# Altium schematic sheet MX8M-Nano-Power.SchDoc: Nova
size A3; SheetNumber: 3; SheetTotal: 15
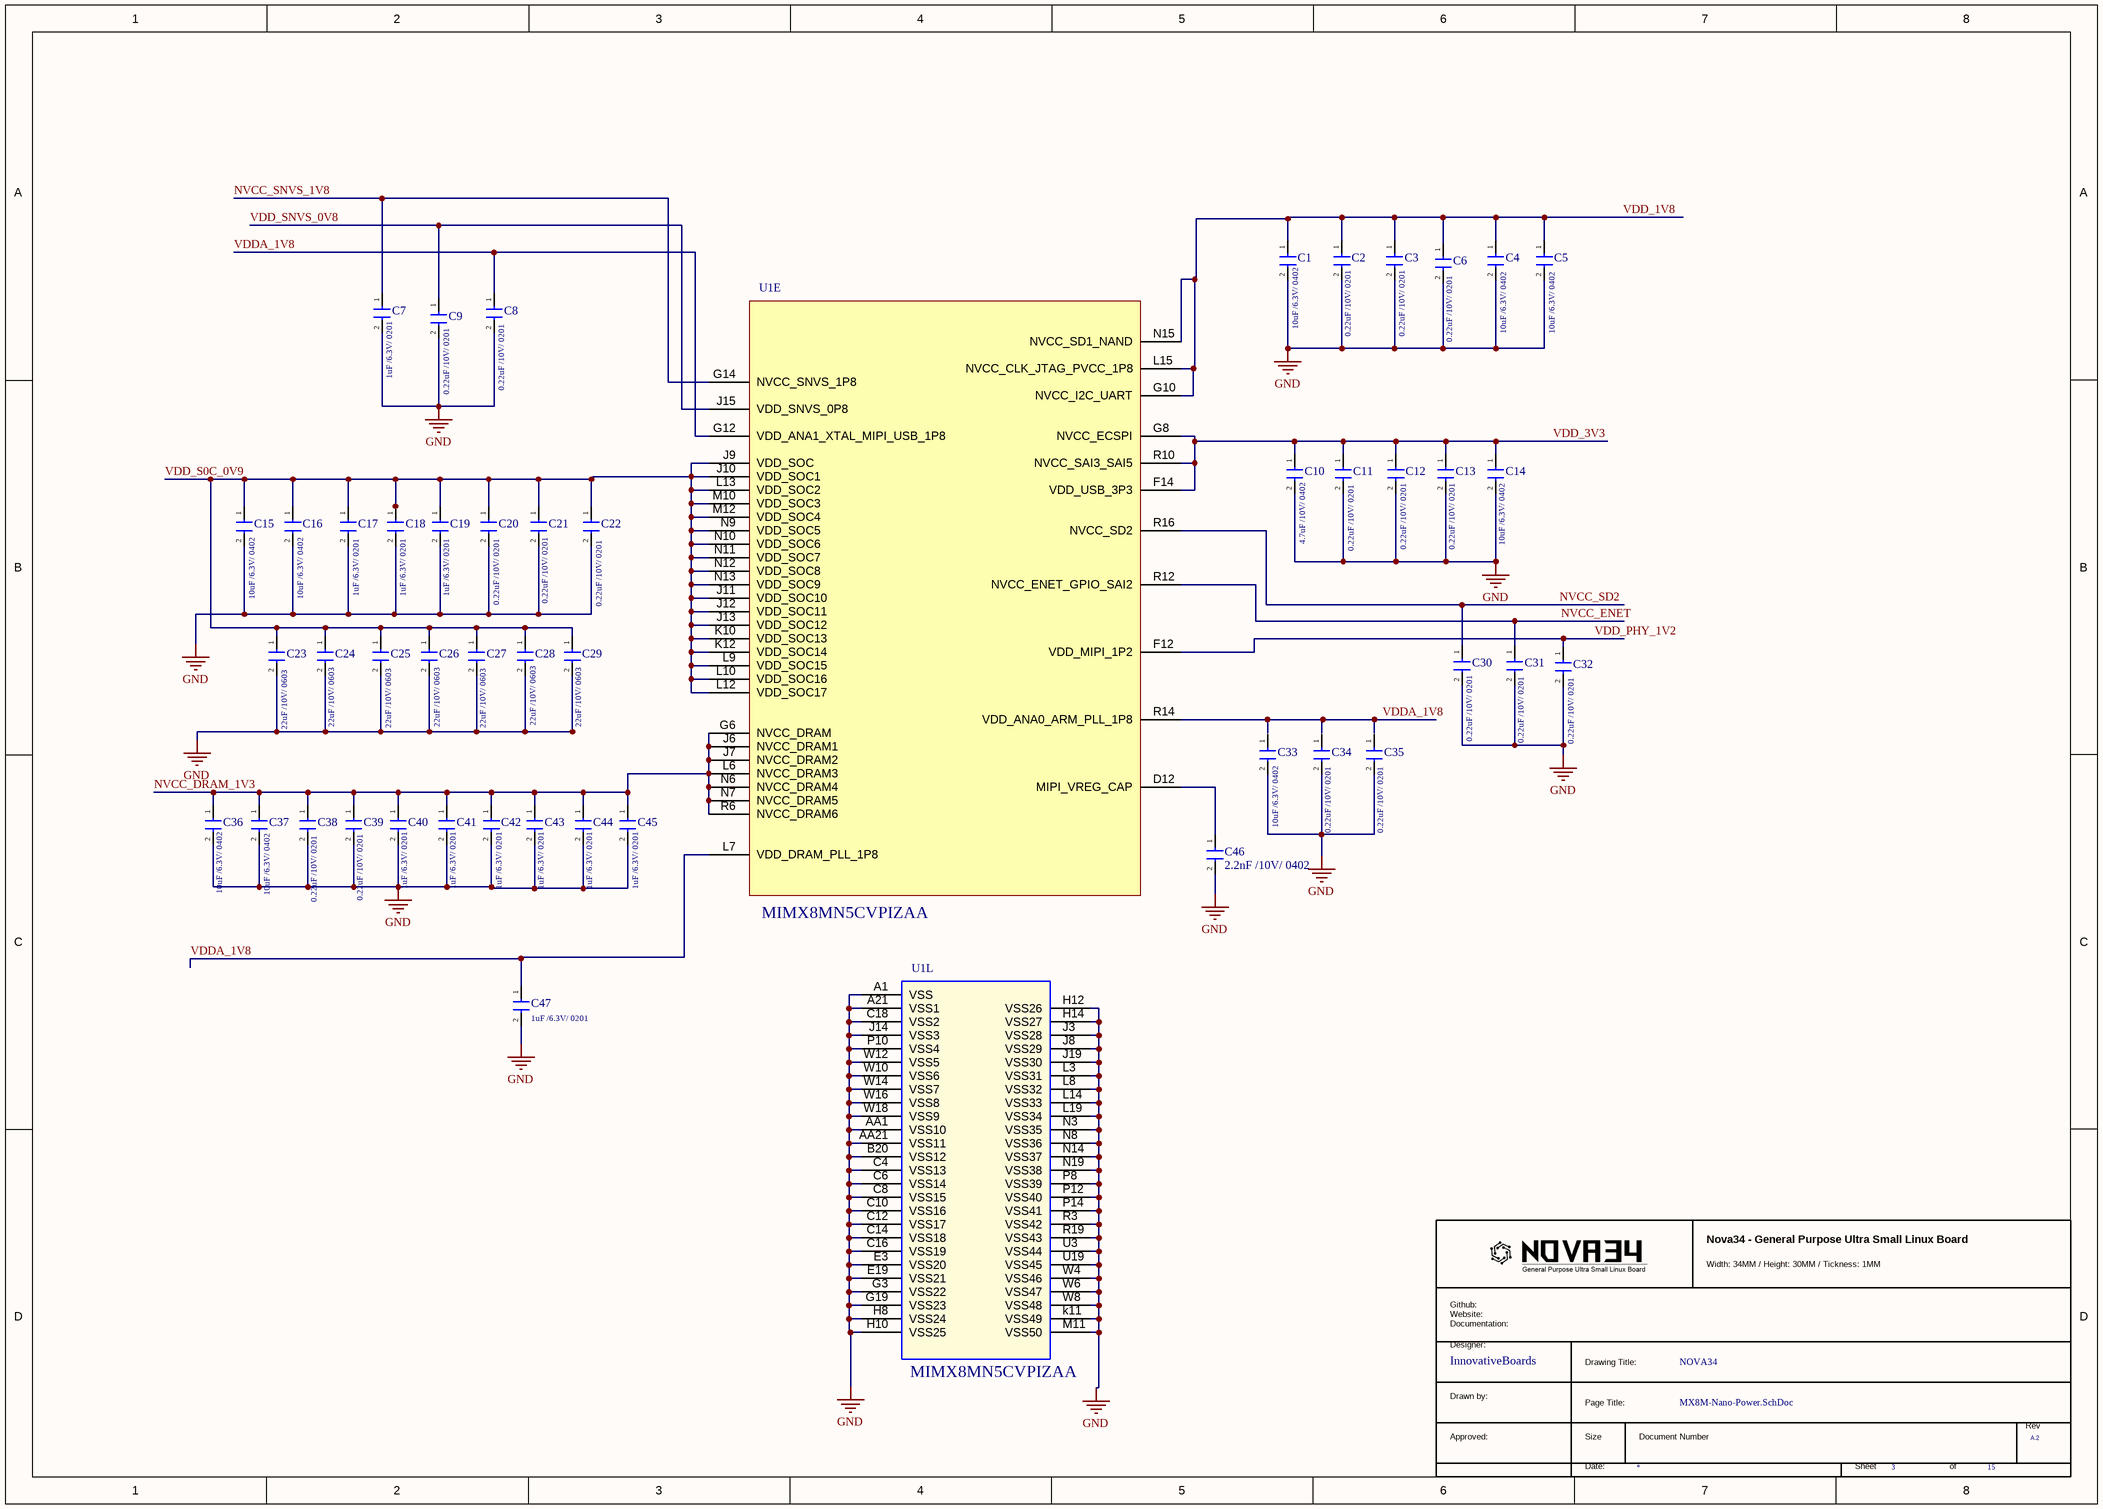
[diagram p0: MX8M-Nano-Power.SchDoc]

## Parts
*  RevCode: A.2  (hidden comment: TitleBlock_MCPG)  (graphical)
C1  10uF /6.3V/ 0402  [CAPC1005X65N]
C2  0.22uF /10V/ 0201  [GRM033D70J224ME01D]
C3  0.22uF /10V/ 0201  [GRM033D70J224ME01D]
C4  10uF /6.3V/ 0402  [CAPC1005X65N]
C5  10uF /6.3V/ 0402  [CAPC1005X65N]
C6  0.22uF /10V/ 0201  [GRM033D70J224ME01D]
C7  1uF /6.3V/ 0201  [GRM033D70J224ME01D]
C8  0.22uF /10V/ 0201  [GRM033D70J224ME01D]
C9  0.22uF /10V/ 0201  [GRM033D70J224ME01D]
C10  4.7uF /10V/ 0402  [CAPC1005X70N]
C11  0.22uF /10V/ 0201  [GRM033D70J224ME01D]
C12  0.22uF /10V/ 0201  [GRM033D70J224ME01D]
C13  0.22uF /10V/ 0201  [GRM033D70J224ME01D]
C14  10uF /6.3V/ 0402  [CAPC1005X65N]
C15  10uF /6.3V/ 0402  [CAPC1005X65N]
C16  10uF /6.3V/ 0402  [CAPC1005X65N]
C17  1uF /6.3V/ 0201  [GRM033D70J224ME01D]
C18  1uF /6.3V/ 0201  [GRM033D70J224ME01D]
C19  1uF /6.3V/ 0201  [GRM033D70J224ME01D]
C20  0.22uF /10V/ 0201  [GRM033D70J224ME01D]
C21  0.22uF /10V/ 0201  [GRM033D70J224ME01D]
C22  0.22uF /10V/ 0201  [GRM033D70J224ME01D]
C23  22uF /10V/ 0603  [GRM18x]
C24  22uF /10V/ 0603  [GRM18x]
C25  22uF /10V/ 0603  [GRM18x]
C26  22uF /10V/ 0603  [GRM18x]
C27  22uF /10V/ 0603  [GRM18x]
C28  22uF /10V/ 0603  [GRM18x]
C29  22uF /10V/ 0603  [GRM18x]
C30  0.22uF /10V/ 0201  [GRM033D70J224ME01D]
C31  0.22uF /10V/ 0201  [GRM033D70J224ME01D]
C32  0.22uF /10V/ 0201  [GRM033D70J224ME01D]
C33  10uF /6.3V/ 0402  [CAPC1005X65N]
C34  0.22uF /10V/ 0201  [GRM033D70J224ME01D]
C35  0.22uF /10V/ 0201  [GRM033D70J224ME01D]
C36  10uF /6.3V/ 0402  [CAPC1005X65N]
C37  10uF /6.3V/ 0402  [CAPC1005X65N]
C38  0.22uF /10V/ 0201  [GRM033D70J224ME01D]
C39  0.22uF /10V/ 0201  [GRM033D70J224ME01D]
C40  1uF /6.3V/ 0201  [GRM033D70J224ME01D]
C41  1uF /6.3V/ 0201  [GRM033D70J224ME01D]
C42  1uF /6.3V/ 0201  [GRM033D70J224ME01D]
C43  1uF /6.3V/ 0201  [GRM033D70J224ME01D]
C44  1uF /6.3V/ 0201  [GRM033D70J224ME01D]
C45  1uF /6.3V/ 0201  [GRM033D70J224ME01D]
C46  2.2nF /10V/ 0402  [CAPC1005X70N]
C47  1uF /6.3V/ 0201  [GRM033D70J224ME01D]
U1  MIMX8MN5CVPIZAA  [BGA306C50P21X21_1100X1100X101]  (parts E,L of 12)

## Nets
GND: C1.2 C2.2 C3.2 C4.2 C5.2 C6.2 C7.2 C8.2 C9.2 C10.2 C11.2 C12.2 C13.2 C14.2 C15.2 C16.2 C17.2 C18.2 C19.2 C20.2 C21.2 C22.2 C23.2 C24.2 C25.2 C26.2 C27.2 C28.2 C29.2 C30.2 C31.2 C32.2 C33.2 C34.2 C35.2 C36.2 C37.2 C38.2 C39.2 C40.2 C41.2 C42.2 C43.2 C44.2 C45.2 C46.2 C47.2 U1.A1(VSS) U1.A21(VSS1) U1.AA1(VSS10) U1.AA21(VSS11) U1.B20(VSS12) U1.C4(VSS13) U1.C6(VSS14) U1.C8(VSS15) U1.C10(VSS16) U1.C12(VSS17) U1.C14(VSS18) U1.C16(VSS19) U1.C18(VSS2) U1.E3(VSS20) U1.E19(VSS21) U1.G3(VSS22) U1.G19(VSS23) U1.H8(VSS24) U1.H10(VSS25) U1.H12(VSS26) U1.H14(VSS27) U1.J3(VSS28) U1.J8(VSS29) U1.J14(VSS3) U1.J19(VSS30) U1.k11(VSS49) U1.L3(VSS31) U1.L8(VSS32) U1.L14(VSS33) U1.L19(VSS34) U1.M11(VSS50) U1.N3(VSS35) U1.N8(VSS36) U1.N14(VSS37) U1.N19(VSS38) U1.P8(VSS39) U1.P10(VSS4) U1.P12(VSS40) U1.P14(VSS41) U1.R3(VSS42) U1.R19(VSS43) U1.U3(VSS44) U1.U19(VSS45) U1.W4(VSS46) U1.W6(VSS47) U1.W8(VSS48) U1.W10(VSS6) U1.W12(VSS5) U1.W14(VSS7) U1.W16(VSS8) U1.W18(VSS9)
NVCC_DRAM_1V3: C36.1 C37.1 C38.1 C39.1 C40.1 C41.1 C42.1 C43.1 C44.1 C45.1 U1.G6(NVCC_DRAM) U1.J6(NVCC_DRAM1) U1.J7(NVCC_DRAM2) U1.L6(NVCC_DRAM3) U1.N6(NVCC_DRAM4) U1.N7(NVCC_DRAM5) U1.R6(NVCC_DRAM6)
NVCC_ENET: C31.1 U1.R12(NVCC_ENET_GPIO_SAI2)
NVCC_SD2: C30.1 U1.R16(NVCC_SD2)
NVCC_SNVS_1V8: C7.1 U1.G14(NVCC_SNVS_1P8)
VDD_1V8: C1.1 C2.1 C3.1 C4.1 C5.1 C6.1 U1.G10(NVCC_I2C_UART) U1.L15(NVCC_CLK_JTAG_PVCC_1P8) U1.N15(NVCC_SD1_NAND)
VDD_3V3: C10.1 C11.1 C12.1 C13.1 C14.1 U1.F14(VDD_USB_3P3) U1.G8(NVCC_ECSPI) U1.R10(NVCC_SAI3_SAI5)
VDD_PHY_1V2: C32.1 U1.F12(VDD_MIPI_1P2)
VDD_S0C_0V9: C15.1 C16.1 C17.1 C18.1 C19.1 C20.1 C21.1 C22.1 C23.1 C24.1 C25.1 C26.1 C27.1 C28.1 C29.1 U1.J9(VDD_SOC) U1.J10(VDD_SOC1) U1.J11(VDD_SOC10) U1.J12(VDD_SOC11) U1.J13(VDD_SOC12) U1.K10(VDD_SOC13) U1.K12(VDD_SOC14) U1.L9(VDD_SOC15) U1.L10(VDD_SOC16) U1.L12(VDD_SOC17) U1.L13(VDD_SOC2) U1.M10(VDD_SOC3) U1.M12(VDD_SOC4) U1.N9(VDD_SOC5) U1.N10(VDD_SOC6) U1.N11(VDD_SOC7) U1.N12(VDD_SOC8) U1.N13(VDD_SOC9)
VDD_SNVS_0V8: C9.1 U1.J15(VDD_SNVS_0P8)
VDDA_1V8: C8.1 C47.1 U1.G12(VDD_ANA1_XTAL_MIPI_USB_1P8) U1.L7(VDD_DRAM_PLL_1P8) U1.R14(VDD_ANA0_ARM_PLL_1P8)
NetC46_1: C46.1 U1.D12(MIPI_VREG_CAP)

Not connected (* = marked no-connect by the designer): C33 1; C34 1; C35 1

## Notes on the sheet
- DWG. NO.
- REV.
- SHT.
- REVISION
- DESCRIPTION
- DATE
- APPROVED
- THIS DOCUMENT AND THE DATA DISCLOSED HEREIN OR HEREWITH IS THE PROPERTY OF ALTIUM LIMITED AND MAY BE FREELY DISTRIBUTED IN WHOLE. NO RIGHTS ARE RESERVED OR EXPRESS OR IMPLIED WARANTEE GIVEN.
- ENG:
- DSN:
- APPROVALS
- PROJECT
- DOCUMENT REVISION:
- DESIGN ITEM:
- CHK:
- BOM:
- REFERENCE DOCUMENTS
- PROJECT REVISION:
- TITLE
- FAB DWG:
- PCB DWG:
- ASSY DWG:
- SCALE:
- SIZE
- C
- CAGE CODE
- FILE NAME
- DWG NO.
- SHEET
- OF
- REV
- (in symbol TitleBlock_MCPG) Nova34 - General Purpose Ultra Small Linux Board; Width: 34MM / Height: 30MM / Tickness: 1MM; Github: / Website: / Documentation:; Designer:; InnovativeBoards; Drawing Title:; NOVA34; Drawn by:; Page Title:; Rev; Approved:; Size; Document Number; Date:; Sheet; of

## Library data of the parts
C1 C4 C5 C14-C16 C33 C36 C37 = GRM155R60J106ME15D: Multilayer Ceramic Capacitors MLCC - SMD/SMT 10 uF 6.3 VDC 20% 0402 X5R; Manufacturer_Name: Murata Electronics; Datasheet Link: https://search.murata.co.jp/Ceramy/image/img/A01X/G101/ENG/GRM155R60J106ME15-01A.pdf; Height: 0.65mm; Manufacturer_Part_Number: GRM155R60J106ME15D; Mouser Part Number: 81-GRM155R60J106ME5D; Mouser Price/Stock: https://www.mouser.co.uk/ProductDetail/Murata-Electronics/GRM155R60J106ME15D?qs=I53XXhTNm8s65u6%252BR3mHqw%3D%3D; Arrow Part Number: GRM155R60J106ME15D; Arrow Price/Stock: https://www.arrow.com/en/products/grm155r60j106me15d/murata-manufacturing?region=nac
C2 C3 C6 C8 C9 C11-C13 C20-C22 C30-C32 C34 C35 C38 C39 = GRM033C81A224KE01J: Multilayer Ceramic Capacitors MLCC - SMD/SMT 0201 10VDC 0.22 F 10 X6S; Manufacturer_Name: Murata Electronics; Datasheet Link: https://search.murata.co.jp/Ceramy/image/img/A01X/G101/ENG/GRM033C81A224KE01-01A.pdf; Height: 0.33mm; Manufacturer_Part_Number: GRM033C81A224KE01J; Mouser Part Number: 81-GRM033C81A224KE1J; Mouser Price/Stock: https://www.mouser.co.uk/ProductDetail/Murata-Electronics/GRM033C81A224KE01J?qs=ufv2HEpFn%252BSIVjJJafvajA%3D%3D
C7 C17-C19 C40-C45 C47 = GRM033C80J105ME05J: Multilayer Ceramic Capacitors MLCC - SMD/SMT 1 uF 6.3 VDC 20% 0201 X6S; Manufacturer_Name: Murata Electronics; Datasheet Link: https://search.murata.co.jp/Ceramy/image/img/A01X/G101/ENG/GRM033C80J105ME05-01A.pdf; Height: 0.33mm; Manufacturer_Part_Number: GRM033C80J105ME05J; Mouser Part Number: 81-GRM033C80J105ME5J; Mouser Price/Stock: https://www.mouser.co.uk/ProductDetail/Murata-Electronics/GRM033C80J105ME05J?qs=5aG0NVq1C4we89LuRh7HJA%3D%3D; Arrow Part Number: GRM033C80J105ME05J; Arrow Price/Stock: https://www.arrow.com/en/products/grm033c80j105me05j/murata-manufacturing?region=nac
C10 = GRT155C81A475ME13J: Multilayer Ceramic Capacitors MLCC - SMD/SMT 0402 X6S 4.7 F 20 10VDC AEC-Q200; Manufacturer_Name: Murata Electronics; Datasheet Link: https://search.murata.co.jp/Ceramy/image/img/A01X/G101/ENG/GRT155C81A475ME13-01A.pdf; Height: 0.7mm; Manufacturer_Part_Number: GRT155C81A475ME13J; Mouser Part Number: 81-GRT155C81A475ME3J; Mouser Price/Stock: https://www.mouser.co.uk/ProductDetail/Murata-Electronics/GRT155C81A475ME13J?qs=ufv2HEpFn%252BS%252BPUDm1eQCHw%3D%3D
C23-C29 = GRM187R61A226ME15D: Multilayer Ceramic Capacitors MLCC - SMD/SMT 22 uF 10 VDC 20% 0603 X5R; Manufacturer_Name: Murata Electronics; Datasheet Link: https://search.murata.co.jp/Ceramy/image/img/A01X/G101/ENG/GRM187R61A226ME15-01A.pdf; Height: 0.9mm; Manufacturer_Part_Number: GRM187R61A226ME15D; Mouser Part Number: 81-GRM187R61A226ME5D; Mouser Price/Stock: https://www.mouser.co.uk/ProductDetail/Murata-Electronics/GRM187R61A226ME15D?qs=I53XXhTNm8uUaeh8Eawx4Q%3D%3D; Arrow Part Number: GRM187R61A226ME15D; Arrow Price/Stock: https://www.arrow.com/en/products/grm187r61a226me15d/murata-manufacturing?region=nac
C46 = GRM155R61A222KA01D: Multilayer Ceramic Capacitors MLCC - SMD/SMT 2200 pF 10 VDC 10% 0402 X5R; Manufacturer_Name: Murata Electronics; Datasheet Link: https://search.murata.co.jp/Ceramy/image/img/A01X/G101/ENG/GRM155R61A222KA01-01A.pdf; Height: 0.7mm; Manufacturer_Part_Number: GRM155R61A222KA01D; Mouser Part Number: 81-GRM155R61A222KA1D; Mouser Price/Stock: https://www.mouser.co.uk/ProductDetail/Murata-Electronics/GRM155R61A222KA01D?qs=y02iAgv9n60wExGWvVZZNg%3D%3D
U1 = MIMX8MN: IC CPU QUAD CORTEX A53+M7 1.4GHZ -- BGA306; PCB Footprint: pbga306_0p5_sq11mm; AGILE_PN: TMP-CIP-5098; CAD_APPROVED: Yes; PRE_APN: 330-77152; Temp Range: -40¡ãC to 105¡ãC; MFG_NAME01: NXP SEMICONDUCTORS; CLASS: IC; HEIGHT: 1.01MM; ROHS: Yes; MFG_PN01: MIMX8MN5CVPIZAA
* = TitleBlock_MCPG: Page Create Date: March  8, 1995